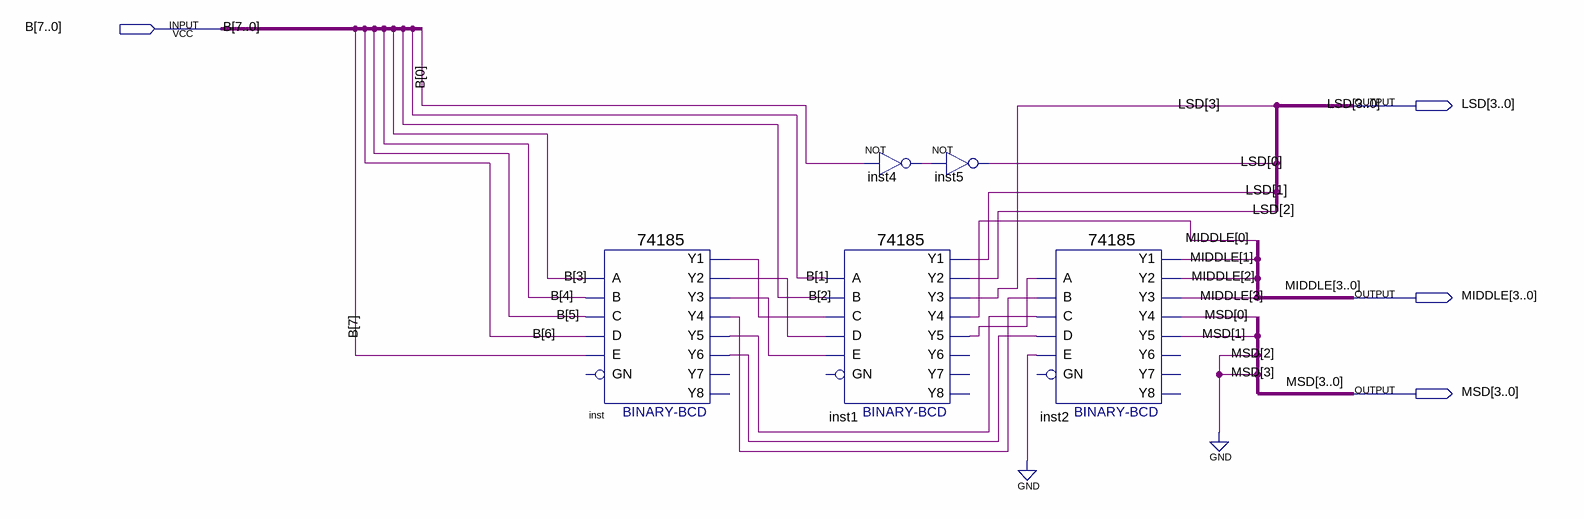
[diagram p0: schematic sheet]
// Quartus schematic conversorbinbcd.bdf as structural Verilog: 5 symbols, 4 pins
module conversorbinbcd (
  input  [7:0] B,
  output [3:0] LSD,
  output [3:0] MIDDLE,
  output [3:0] MSD
);

  wire inst1_y5, inst4_out, inst_y1, inst_y2, inst_y3, inst_y4, inst_y5, inst_y6;

  \74185  inst (
    .A(B[3]), .B(B[4]), .D(B[6]), .C(B[5]), .E(B[7]), .Y1(inst_y1), .Y3(inst_y3), .Y2(inst_y2), .Y5(inst_y5),
    .Y4(inst_y4), .Y6(inst_y6));  // open: GN, Y8, Y7
  \74185  inst1 (
    .A(B[1]), .B(B[2]), .D(inst_y2), .C(inst_y1), .E(inst_y3), .Y1(LSD[1]), .Y3(LSD[3]), .Y2(LSD[2]),
    .Y5(inst1_y5), .Y4(MIDDLE[0]));  // open: GN, Y6, Y8, Y7
  not inst4 (inst4_out, B[0]);
  not inst5 (LSD[0], inst4_out);
  \74185  inst2 (
    .A(inst1_y5), .B(inst_y4), .D(inst_y6), .C(inst_y5), .E(1'b0), .Y1(MIDDLE[1]), .Y3(MIDDLE[3]),
    .Y2(MIDDLE[2]), .Y5(MSD[1]), .Y4(MSD[0]));  // open: GN, Y6, Y8, Y7

  assign MSD[3:2] = 2'b00;
endmodule
